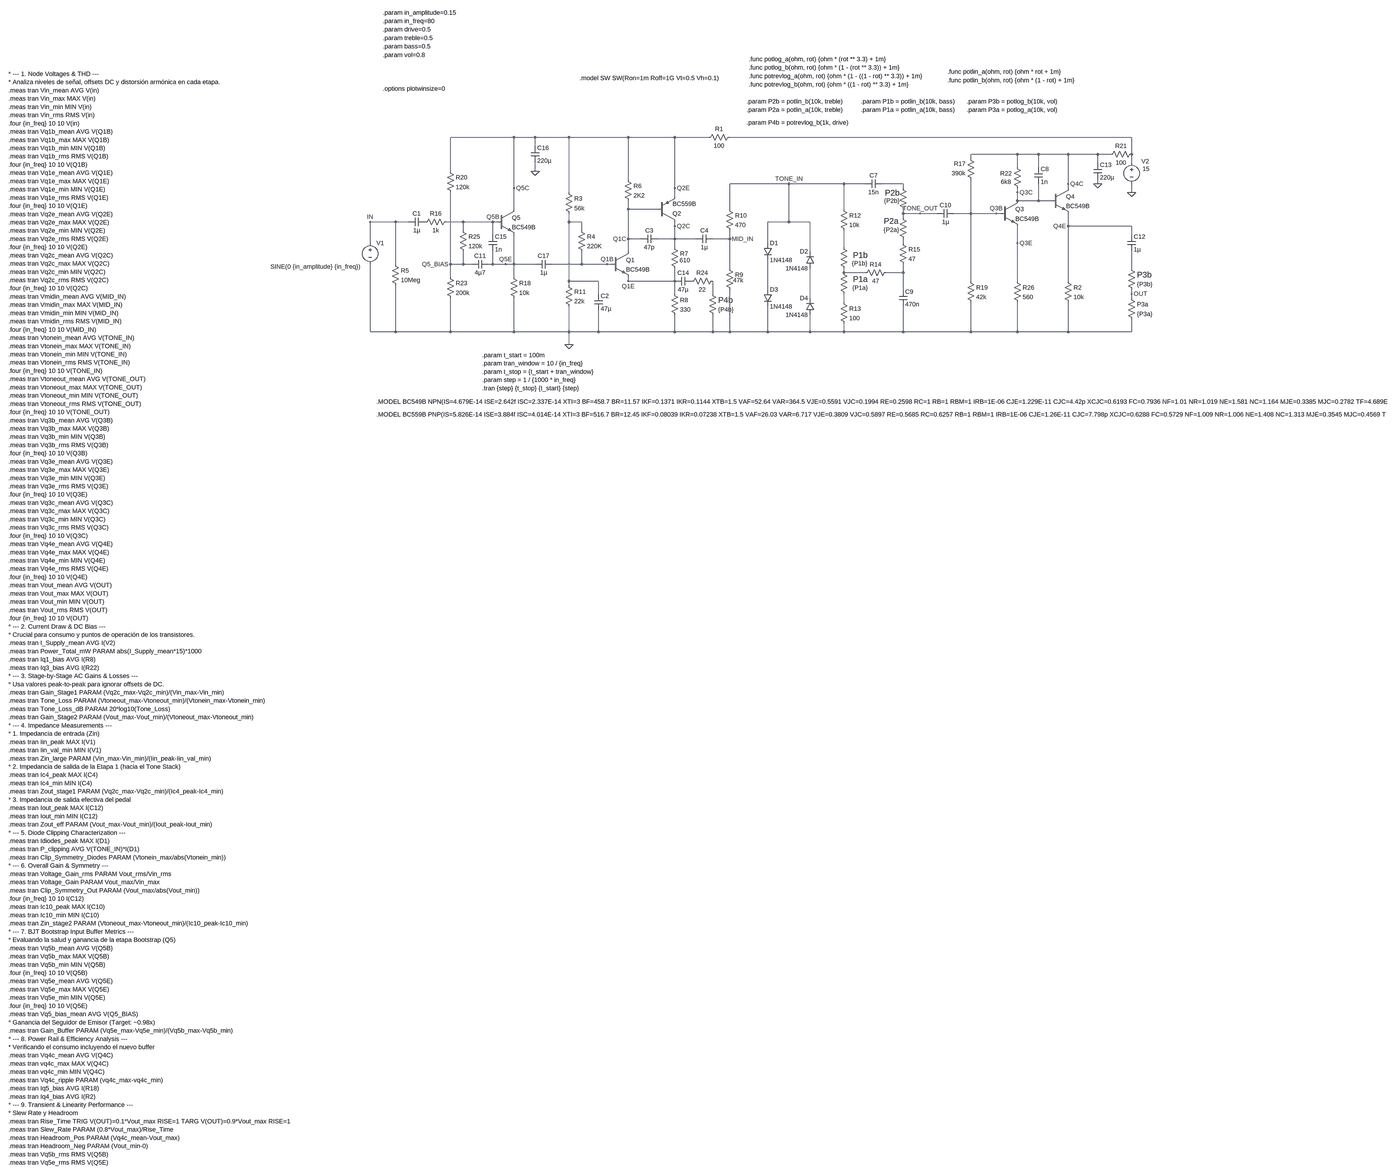
[diagram p0: schematic redesign_15v.asc, whole sheet]
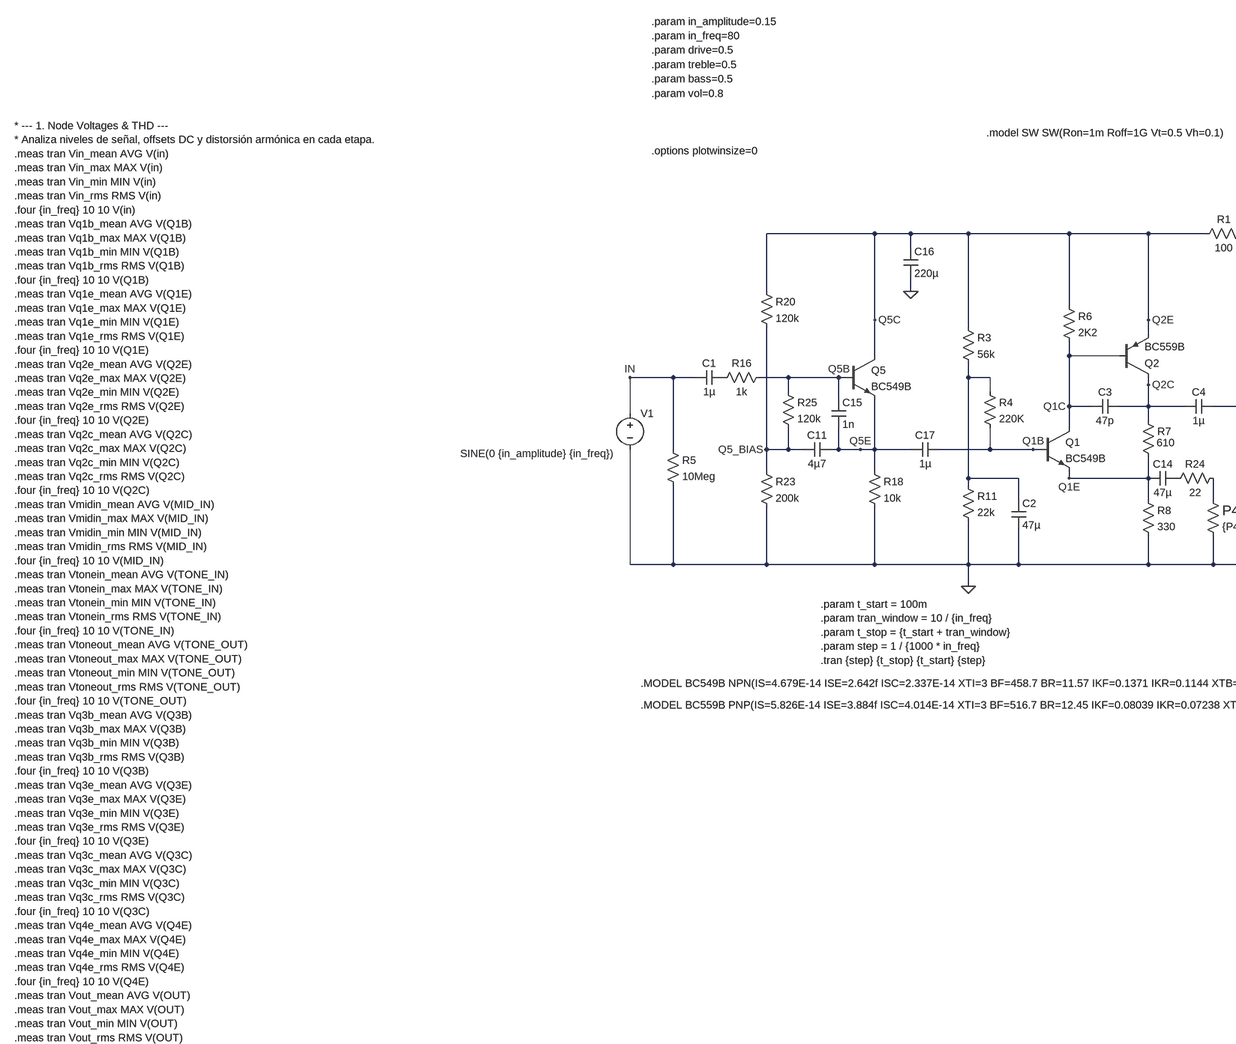
[diagram p1: schematic redesign_15v.asc, part, row 1 of 2, column 1 of 2]
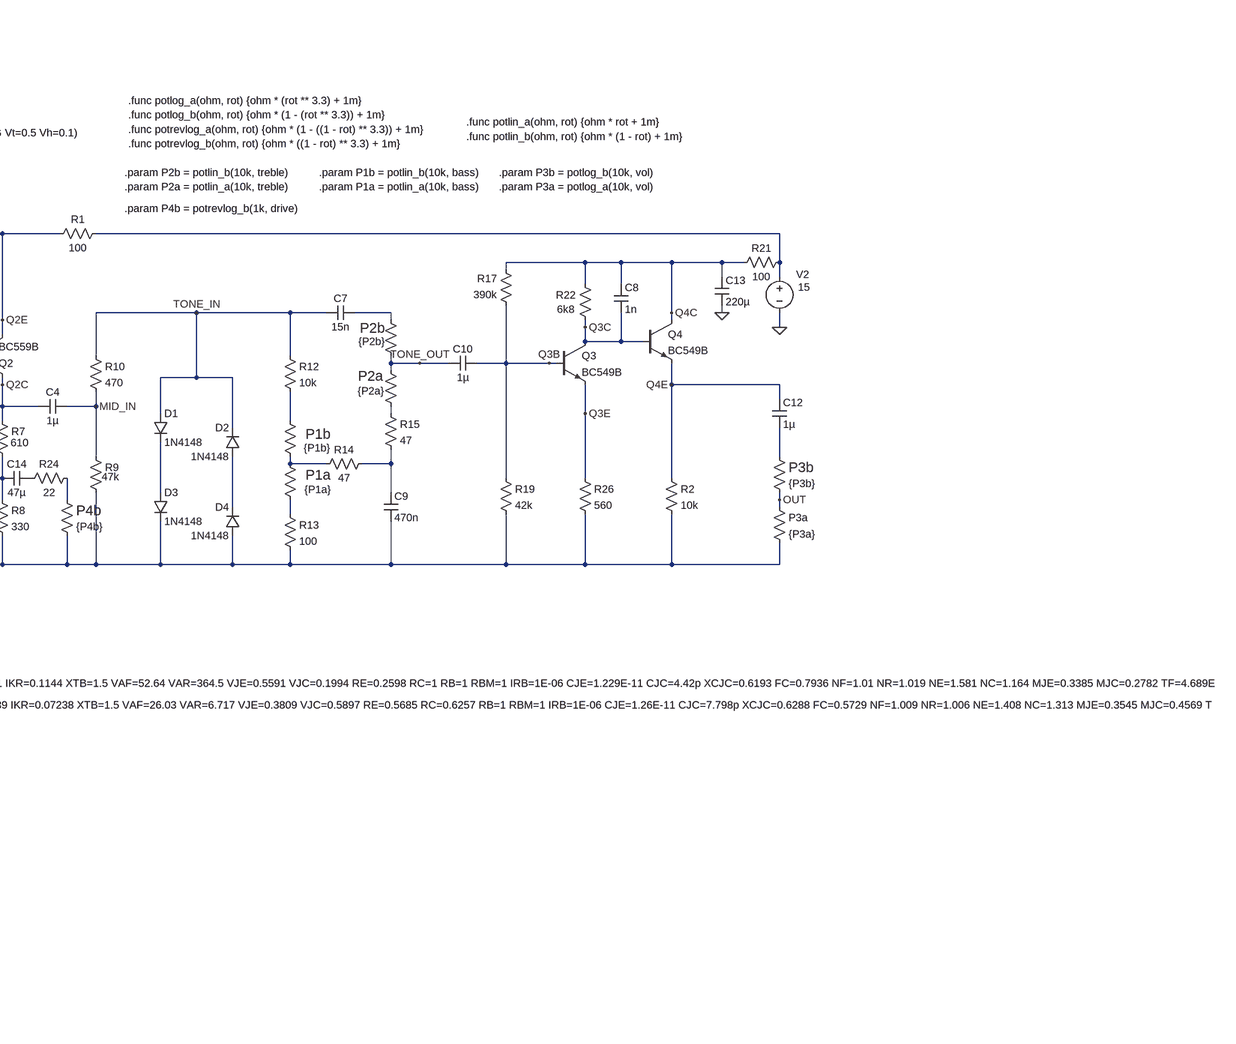
[diagram p2: schematic redesign_15v.asc, part, row 1 of 2, column 2 of 2]
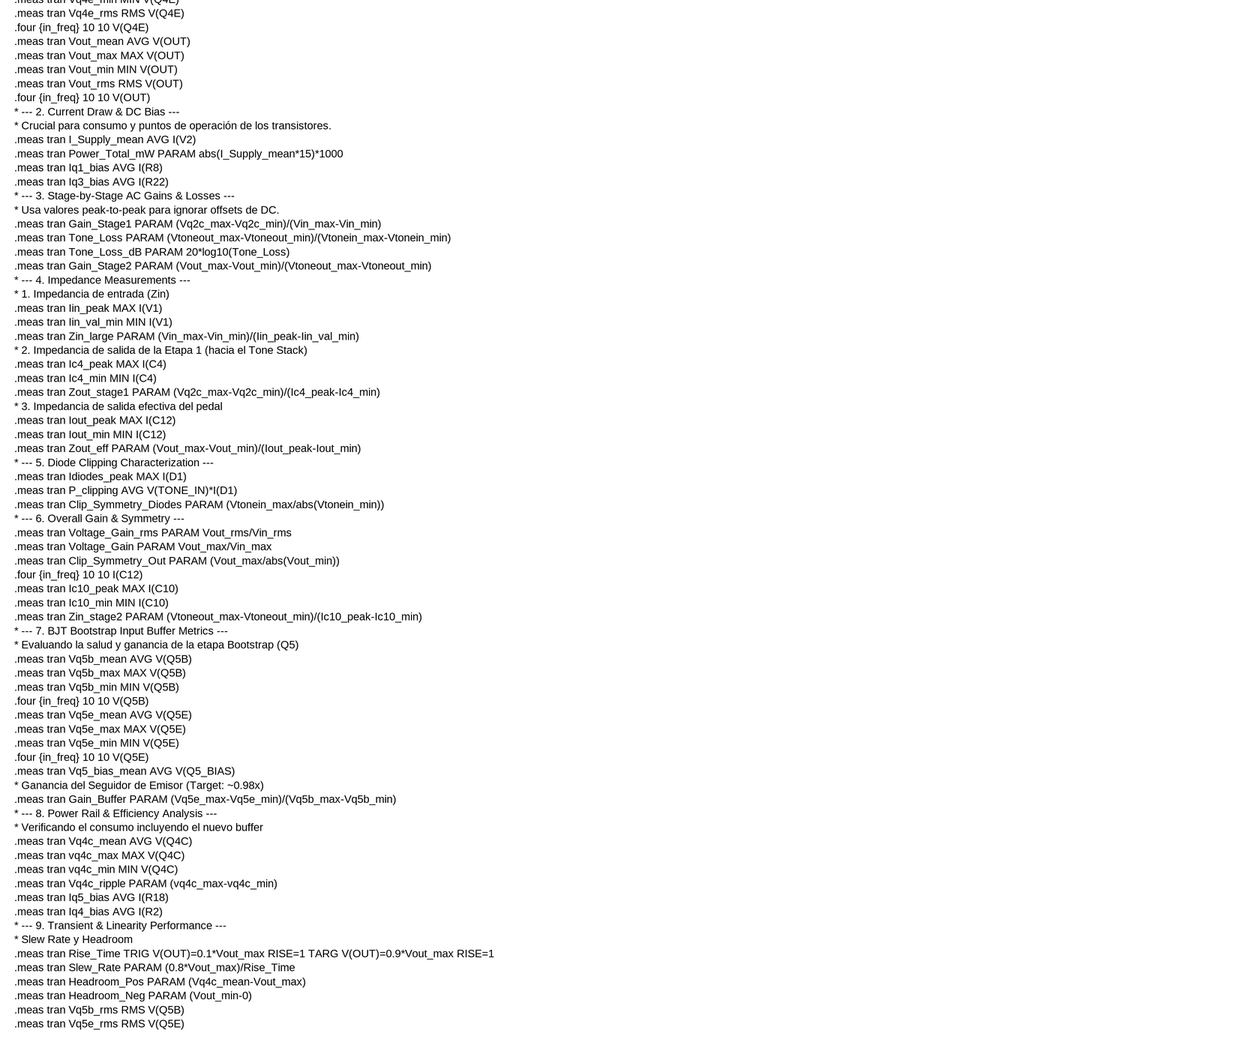
[diagram p3: schematic redesign_15v.asc, part, row 2 of 2, column 1 of 2]
redesign_15v.asc, the LTspice schematic file:
Version 4
SHEET 1 4560 2564
WIRE 96 -160 -144 -160
WIRE 176 -160 96 -160
WIRE 304 -160 176 -160
WIRE 528 -160 304 -160
WIRE 704 -160 528 -160
WIRE 832 -160 704 -160
WIRE 2432 -160 912 -160
WIRE 176 -128 176 -160
WIRE 2000 -96 1824 -96
WIRE 2080 -96 2000 -96
WIRE 2192 -96 2080 -96
WIRE 2304 -96 2192 -96
WIRE 2352 -96 2304 -96
WIRE 2432 -96 2432 -160
WIRE 1824 -80 1824 -96
WIRE 2304 -64 2304 -96
WIRE 2432 -64 2432 -96
WIRE 2000 -48 2000 -96
WIRE 2080 -48 2080 -96
WIRE -144 -32 -144 -160
WIRE 176 -32 176 -64
WIRE 528 0 528 -160
WIRE 1136 16 912 16
WIRE 1344 16 1136 16
WIRE 1424 16 1344 16
WIRE 1568 16 1488 16
WIRE 2192 16 2192 -96
WIRE 2304 16 2304 0
WIRE 96 32 96 -160
WIRE 704 32 704 -160
WIRE 1568 32 1568 16
WIRE 2192 32 2192 16
WIRE 304 48 304 -160
WIRE 2000 48 2000 32
WIRE 2432 48 2432 16
WIRE 704 64 704 32
WIRE 2000 80 2000 48
WIRE 2080 80 2080 16
WIRE 2080 80 2000 80
WIRE 2128 80 2080 80
WIRE 96 112 96 32
WIRE 528 112 528 80
WIRE 640 112 528 112
WIRE 912 112 912 16
WIRE 1344 112 1344 16
WIRE 1568 128 1568 112
WIRE 1632 128 1568 128
WIRE 1696 128 1632 128
WIRE 1824 128 1824 0
WIRE 1824 128 1760 128
WIRE 1920 128 1824 128
WIRE 1936 128 1920 128
WIRE 1568 144 1568 128
WIRE -352 160 -448 160
WIRE -304 160 -352 160
WIRE -96 160 -160 160
WIRE 16 160 -96 160
WIRE 32 160 16 160
WIRE 304 160 304 128
WIRE 352 160 304 160
WIRE 1136 160 1136 16
WIRE 1136 160 1056 160
WIRE 1216 160 1136 160
WIRE 704 176 704 160
WIRE 2192 176 2192 128
WIRE 2432 176 2192 176
WIRE -96 192 -96 160
WIRE 352 192 352 160
WIRE 16 208 16 160
WIRE 2432 208 2432 176
WIRE 528 224 528 112
WIRE 576 224 528 224
WIRE 704 224 704 176
WIRE 704 224 640 224
WIRE 784 224 704 224
WIRE 912 224 912 192
WIRE 912 224 848 224
WIRE -448 240 -448 160
WIRE 1056 240 1056 160
WIRE 1568 240 1568 224
WIRE 2000 240 2000 176
WIRE 704 256 704 224
WIRE 1344 256 1344 192
WIRE 528 272 528 224
WIRE 1216 272 1216 160
WIRE -352 320 -352 160
WIRE -144 320 -144 48
WIRE -96 320 -96 272
WIRE -96 320 -144 320
WIRE -64 320 -96 320
WIRE 16 320 16 272
WIRE 16 320 0 320
WIRE 64 320 16 320
WIRE 96 320 96 208
WIRE 96 320 64 320
WIRE 176 320 96 320
WIRE 352 320 352 272
WIRE 352 320 240 320
WIRE 448 320 352 320
WIRE 464 320 448 320
WIRE 912 336 912 224
WIRE 2432 336 2432 272
WIRE 1344 352 1344 336
WIRE 1424 352 1344 352
WIRE 1568 352 1568 320
WIRE 1568 352 1504 352
WIRE -144 368 -144 320
WIRE 96 368 96 320
WIRE 304 384 304 160
WIRE 416 384 304 384
WIRE 528 384 528 368
WIRE 704 384 704 336
WIRE 704 384 528 384
WIRE 1824 384 1824 128
WIRE 2000 384 2000 240
WIRE 2192 384 2192 176
WIRE 304 400 304 384
WIRE 1056 416 1056 304
WIRE 1568 416 1568 352
WIRE 416 432 416 384
WIRE 704 432 704 384
WIRE 848 432 848 384
WIRE 2432 432 2432 416
WIRE 1216 448 1216 336
WIRE 2432 448 2432 432
WIRE 1344 464 1344 432
WIRE -448 576 -448 320
WIRE -352 576 -352 400
WIRE -352 576 -448 576
WIRE -144 576 -144 448
WIRE -144 576 -352 576
WIRE 96 576 96 448
WIRE 96 576 -144 576
WIRE 304 576 304 480
WIRE 304 576 96 576
WIRE 416 576 416 496
WIRE 416 576 304 576
WIRE 704 576 704 512
WIRE 704 576 416 576
WIRE 848 576 848 512
WIRE 848 576 704 576
WIRE 912 576 912 416
WIRE 912 576 848 576
WIRE 1056 576 1056 480
WIRE 1056 576 912 576
WIRE 1216 576 1216 512
WIRE 1216 576 1056 576
WIRE 1344 576 1344 544
WIRE 1344 576 1216 576
WIRE 1568 576 1568 480
WIRE 1568 576 1344 576
WIRE 1824 576 1824 464
WIRE 1824 576 1568 576
WIRE 2000 576 2000 464
WIRE 2000 576 1824 576
WIRE 2192 576 2192 464
WIRE 2192 576 2000 576
WIRE 2432 576 2432 528
WIRE 2432 576 2192 576
WIRE 304 624 304 576
FLAG 2432 48 0
FLAG 448 320 Q1B
FLAG 528 224 Q1C
FLAG 528 384 Q1E
FLAG 704 176 Q2C
FLAG 704 32 Q2E
FLAG 2000 240 Q3E
FLAG 2432 432 OUT
FLAG 304 624 0
FLAG -448 160 IN
FLAG 2304 16 0
FLAG 1632 128 TONE_OUT
FLAG 1136 16 TONE_IN
FLAG 1920 128 Q3B
FLAG 912 224 MID_IN
FLAG 2192 176 Q4E
FLAG 2192 16 Q4C
FLAG 2000 48 Q3C
FLAG 176 -32 0
FLAG 16 160 Q5B
FLAG 96 32 Q5C
FLAG -144 320 Q5_BIAS
FLAG 64 320 Q5E
DATAFLAG 304 160 "round($*100)/100"
DATAFLAG 352 320 "round($*100)/100"
DATAFLAG 704 224 "round($*100)/100"
DATAFLAG 528 112 "round($*100)/100"
DATAFLAG 1824 48 "round($*100)/100"
DATAFLAG 2000 304 "round($*100)/100"
DATAFLAG 608 384 "round($*100)/100"
DATAFLAG 864 224 "round($*100)/100"
DATAFLAG 2208 -96 "round($*100)/100"
DATAFLAG 2352 176 "round($*100)/100"
DATAFLAG 2048 80 "round($*100)/100"
DATAFLAG 752 -160 "round($*100)/100"
DATAFLAG -48 160 "round($*100)/100"
DATAFLAG 96 272 "round($*100)/100"
DATAFLAG -144 240 "round($*100)/100"
SYMBOL npn 464 272 R0
SYMATTR InstName Q1
SYMATTR Value BC549B
SYMBOL npn 1936 80 R0
SYMATTR InstName Q3
SYMATTR Value BC549B
SYMBOL Cap 640 208 R90
WINDOW 0 0 32 VBottom 2
WINDOW 3 32 32 VTop 2
SYMATTR InstName C3
SYMATTR Value 47p
SYMBOL Cap 848 208 R90
WINDOW 0 0 32 VBottom 2
WINDOW 3 32 32 VTop 2
SYMATTR InstName C4
SYMATTR Value 1µ
SYMBOL Res 688 240 R0
WINDOW 3 34 65 Left 2
SYMATTR Value 610
SYMATTR InstName R7
SYMBOL Res 288 32 R0
SYMATTR InstName R3
SYMATTR Value 56k
SYMBOL Res 512 -16 R0
SYMATTR InstName R6
SYMATTR Value 2K2
SYMBOL Res 896 96 R0
SYMATTR InstName R10
SYMATTR Value 470
SYMBOL Res 688 416 R0
SYMATTR InstName R8
SYMATTR Value 330
SYMBOL Res 1328 240 R0
WINDOW 0 50 46 Left 3
WINDOW 3 46 77 Left 2
SYMATTR InstName P1b
SYMATTR Value {P1b}
SYMBOL Res 1328 336 R0
WINDOW 0 50 41 Left 3
WINDOW 3 48 73 Left 2
SYMATTR InstName P1a
SYMATTR Value {P1a}
SYMBOL Res 1520 336 R90
WINDOW 0 0 56 VBottom 2
WINDOW 3 32 56 VTop 2
SYMATTR InstName R14
SYMATTR Value 47
SYMBOL Cap 1488 0 R90
WINDOW 0 0 32 VBottom 2
WINDOW 3 32 32 VTop 2
SYMATTR InstName C7
SYMATTR Value 15n
SYMBOL Res 1552 16 R0
WINDOW 3 -56 64 Left 2
WINDOW 0 -53 34 Left 3
SYMATTR Value {P2b}
SYMATTR InstName P2b
SYMBOL Res 1552 128 R0
WINDOW 3 -58 62 Left 2
WINDOW 0 -57 29 Left 3
SYMATTR Value {P2a}
SYMATTR InstName P2a
SYMBOL Cap 1552 416 R0
SYMATTR InstName C9
SYMATTR Value 470n
SYMBOL Cap 1760 112 R90
WINDOW 0 0 32 VBottom 2
WINDOW 3 32 32 VTop 2
SYMATTR InstName C10
SYMATTR Value 1µ
SYMBOL Res 1840 16 R180
WINDOW 0 36 76 Left 2
WINDOW 3 36 40 Left 2
SYMATTR InstName R17
SYMATTR Value 390k
SYMBOL Res 1984 368 R0
SYMATTR InstName R26
SYMATTR Value 560
SYMBOL Res 288 384 R0
SYMATTR InstName R11
SYMATTR Value 22k
SYMBOL Res 1808 368 R0
SYMATTR InstName R19
SYMATTR Value 42k
SYMBOL voltage 2432 -80 R0
WINDOW 0 37 11 Left 2
WINDOW 3 41 39 Left 2
SYMATTR InstName V2
SYMATTR Value 15
SYMBOL pnp 640 160 M180
SYMATTR InstName Q2
SYMATTR Value BC559B
SYMBOL Res 2416 432 R0
SYMATTR InstName P3a
SYMATTR Value {P3a}
SYMBOL Res 2416 320 R0
WINDOW 0 36 40 Left 3
SYMATTR InstName P3b
SYMATTR Value {P3b}
SYMBOL Cap 400 432 R0
SYMATTR InstName C2
SYMATTR Value 47µ
SYMBOL Res 336 176 R0
SYMATTR InstName R4
SYMATTR Value 220K
SYMBOL Res 1328 96 R0
SYMATTR InstName R12
SYMATTR Value 10k
SYMBOL Res 1328 448 R0
SYMATTR InstName R13
SYMATTR Value 100
SYMBOL Res 1552 224 R0
SYMATTR InstName R15
SYMATTR Value 47
SYMBOL Res 896 320 R0
WINDOW 3 29 61 Left 2
SYMATTR Value 47k
SYMATTR InstName R9
SYMBOL Res 2448 -112 R90
WINDOW 0 0 56 VBottom 2
WINDOW 3 32 56 VTop 2
SYMATTR InstName R21
SYMATTR Value 100
SYMBOL Cap 2288 -64 R0
SYMATTR InstName C13
SYMATTR Value 220µ
SYMBOL Voltage -448 224 R0
WINDOW 39 0 0 Left 0
WINDOW 3 -377 105 Left 2
SYMATTR Value SINE(0 {in_amplitude} {in_freq})
SYMATTR InstName V1
SYMBOL Res 1984 -64 R0
WINDOW 0 -49 41 Left 2
WINDOW 3 -47 72 Left 2
SYMATTR InstName R22
SYMATTR Value 6k8
SYMBOL Cap 2416 208 R0
SYMATTR InstName C12
SYMATTR Value 1µ
SYMBOL Cap 768 368 R90
WINDOW 0 0 32 VBottom 2
WINDOW 3 32 32 VTop 2
SYMATTR InstName C14
SYMATTR Value 47µ
SYMBOL Res 864 368 R90
WINDOW 0 0 56 VBottom 2
WINDOW 3 32 56 VTop 2
SYMATTR InstName R24
SYMATTR Value 22
SYMBOL Res 832 416 R0
WINDOW 0 36 40 Left 3
SYMATTR InstName P4b
SYMATTR Value {P4b}
SYMBOL npn 2128 32 R0
SYMATTR InstName Q4
SYMATTR Value BC549B
SYMBOL Res 2176 368 R0
SYMATTR InstName R2
SYMATTR Value 10k
SYMBOL Cap 2064 -48 R0
SYMATTR InstName C8
SYMATTR Value 1n
SYMBOL Res 928 -176 R90
WINDOW 0 0 56 VBottom 2
WINDOW 3 32 56 VTop 2
SYMATTR InstName R1
SYMATTR Value 100
SYMBOL Cap 160 -128 R0
SYMATTR InstName C16
SYMATTR Value 220µ
SYMBOL npn 32 112 R0
SYMATTR InstName Q5
SYMATTR Value BC549B
SYMBOL Res -368 304 R0
SYMATTR InstName R5
SYMATTR Value 10Meg
SYMBOL Cap -240 144 R90
WINDOW 0 0 32 VBottom 2
WINDOW 3 32 32 VTop 2
SYMATTR InstName C1
SYMATTR Value 1µ
SYMBOL Res -144 144 R90
WINDOW 0 0 56 VBottom 2
WINDOW 3 32 56 VTop 2
SYMATTR InstName R16
SYMATTR Value 1k
SYMBOL Res 80 352 R0
SYMATTR InstName R18
SYMATTR Value 10k
SYMBOL Res -160 -48 R0
SYMATTR InstName R20
SYMATTR Value 120k
SYMBOL Res -160 352 R0
SYMATTR InstName R23
SYMATTR Value 200k
SYMBOL Res -112 176 R0
SYMATTR InstName R25
SYMATTR Value 120k
SYMBOL Cap 0 304 R90
WINDOW 0 0 32 VBottom 2
WINDOW 3 32 32 VTop 2
SYMATTR InstName C11
SYMATTR Value 4µ7
SYMBOL Cap 0 208 R0
SYMATTR InstName C15
SYMATTR Value 1n
SYMBOL Cap 240 304 R90
WINDOW 0 0 32 VBottom 2
WINDOW 3 32 32 VTop 2
SYMATTR InstName C17
SYMATTR Value 1µ
SYMBOL diode 1040 240 R0
SYMATTR InstName D1
SYMATTR Value 1N4148
SYMBOL diode 1040 416 R0
SYMATTR InstName D3
SYMATTR Value 1N4148
SYMBOL diode 1232 336 R180
WINDOW 0 24 64 Left 2
WINDOW 3 24 0 Left 2
SYMATTR InstName D2
SYMATTR Value 1N4148
SYMBOL diode 1232 512 R180
WINDOW 0 24 64 Left 2
WINDOW 3 24 0 Left 2
SYMATTR InstName D4
SYMATTR Value 1N4148
TEXT -400 -536 Left 2 !.param treble=0.5
TEXT -400 -568 Left 2 !.param drive=0.5
TEXT 984 -456 Left 2 !.func potlog_a(ohm, rot) {ohm * (rot ** 3.3) + 1m}
TEXT 976 -296 Left 2 !.param P2b = potlin_b(10k, treble)
TEXT 976 -264 Left 2 !.param P2a = potlin_a(10k, treble)
TEXT 1408 -296 Left 2 !.param P1b = potlin_b(10k, bass)
TEXT 1408 -264 Left 2 !.param P1a = potlin_a(10k, bass)
TEXT -400 -504 Left 2 !.param bass=0.5
TEXT 1808 -296 Left 2 !.param P3b = potlog_b(10k, vol)
TEXT 1808 -264 Left 2 !.param P3a = potlog_a(10k, vol)
TEXT -400 -472 Left 2 !.param vol=0.8
TEXT 984 -424 Left 2 !.func potlog_b(ohm, rot) {ohm * (1 - (rot ** 3.3)) + 1m}
TEXT 1736 -408 Left 2 !.func potlin_a(ohm, rot) {ohm * rot + 1m}
TEXT 1736 -376 Left 2 !.func potlin_b(ohm, rot) {ohm * (1 - rot) + 1m}
TEXT 344 -384 Left 2 !.model SW SW(Ron=1m Roff=1G Vt=0.5 Vh=0.1)
TEXT -400 -632 Left 2 !.param in_amplitude=0.15
TEXT -400 -600 Left 2 !.param in_freq=80
TEXT -400 -344 Left 2 !.options plotwinsize=0
TEXT -24 664 Left 2 !.param t_start = 100m\n.param tran_window = 10 / {in_freq}\n.param t_stop = {t_start + tran_window}\n.param step = 1 / {1000 * in_freq}\n.tran {step} {t_stop} {t_start} {step}
TEXT -1816 -400 Left 2 !* --- 1. Node Voltages & THD ---\n* Analiza niveles de señal, offsets DC y distorsión armónica en cada etapa.\n.meas tran Vin_mean AVG V(in)\n.meas tran Vin_max MAX V(in)\n.meas tran Vin_min MIN V(in)\n.meas tran Vin_rms RMS V(in)\n.four {in_freq} 10 10 V(in)\n.meas tran Vq1b_mean AVG V(Q1B)\n.meas tran Vq1b_max MAX V(Q1B)\n.meas tran Vq1b_min MIN V(Q1B)\n.meas tran Vq1b_rms RMS V(Q1B)\n.four {in_freq} 10 10 V(Q1B)\n.meas tran Vq1e_mean AVG V(Q1E)\n.meas tran Vq1e_max MAX V(Q1E)\n.meas tran Vq1e_min MIN V(Q1E)\n.meas tran Vq1e_rms RMS V(Q1E)\n.four {in_freq} 10 10 V(Q1E)\n.meas tran Vq2e_mean AVG V(Q2E)\n.meas tran Vq2e_max MAX V(Q2E)\n.meas tran Vq2e_min MIN V(Q2E)\n.meas tran Vq2e_rms RMS V(Q2E)\n.four {in_freq} 10 10 V(Q2E)\n.meas tran Vq2c_mean AVG V(Q2C)\n.meas tran Vq2c_max MAX V(Q2C)\n.meas tran Vq2c_min MIN V(Q2C)\n.meas tran Vq2c_rms RMS V(Q2C)\n.four {in_freq} 10 10 V(Q2C)\n.meas tran Vmidin_mean AVG V(MID_IN)\n.meas tran Vmidin_max MAX V(MID_IN)\n.meas tran Vmidin_min MIN V(MID_IN)\n.meas tran Vmidin_rms RMS V(MID_IN)\n.four {in_freq} 10 10 V(MID_IN)\n.meas tran Vtonein_mean AVG V(TONE_IN)\n.meas tran Vtonein_max MAX V(TONE_IN)\n.meas tran Vtonein_min MIN V(TONE_IN)\n.meas tran Vtonein_rms RMS V(TONE_IN)\n.four {in_freq} 10 10 V(TONE_IN)\n.meas tran Vtoneout_mean AVG V(TONE_OUT)\n.meas tran Vtoneout_max MAX V(TONE_OUT)\n.meas tran Vtoneout_min MIN V(TONE_OUT)\n.meas tran Vtoneout_rms RMS V(TONE_OUT)\n.four {in_freq} 10 10 V(TONE_OUT)\n.meas tran Vq3b_mean AVG V(Q3B)\n.meas tran Vq3b_max MAX V(Q3B)\n.meas tran Vq3b_min MIN V(Q3B)\n.meas tran Vq3b_rms RMS V(Q3B)\n.four {in_freq} 10 10 V(Q3B)\n.meas tran Vq3e_mean AVG V(Q3E)\n.meas tran Vq3e_max MAX V(Q3E)\n.meas tran Vq3e_min MIN V(Q3E)\n.meas tran Vq3e_rms RMS V(Q3E)\n.four {in_freq} 10 10 V(Q3E)\n.meas tran Vq3c_mean AVG V(Q3C)\n.meas tran Vq3c_max MAX V(Q3C)\n.meas tran Vq3c_min MIN V(Q3C)\n.meas tran Vq3c_rms RMS V(Q3C)\n.four {in_freq} 10 10 V(Q3C)\n.meas tran Vq4e_mean AVG V(Q4E)\n.meas tran Vq4e_max MAX V(Q4E)\n.meas tran Vq4e_min MIN V(Q4E)\n.meas tran Vq4e_rms RMS V(Q4E)\n.four {in_freq} 10 10 V(Q4E)\n.meas tran Vout_mean AVG V(OUT)\n.meas tran Vout_max MAX V(OUT)\n.meas tran Vout_min MIN V(OUT)\n.meas tran Vout_rms RMS V(OUT)\n.four {in_freq} 10 10 V(OUT)\n* --- 2. Current Draw & DC Bias ---\n* Crucial para consumo y puntos de operación de los transistores.\n.meas tran I_Supply_mean AVG I(V2)\n.meas tran Power_Total_mW PARAM abs(I_Supply_mean*15)*1000\n.meas tran Iq1_bias AVG I(R8)\n.meas tran Iq3_bias AVG I(R22)\n* --- 3. Stage-by-Stage AC Gains & Losses ---\n* Usa valores peak-to-peak para ignorar offsets de DC.\n.meas tran Gain_Stage1 PARAM (Vq2c_max-Vq2c_min)/(Vin_max-Vin_min)\n.meas tran Tone_Loss PARAM (Vtoneout_max-Vtoneout_min)/(Vtonein_max-Vtonein_min)\n.meas tran Tone_Loss_dB PARAM 20*log10(Tone_Loss)\n.meas tran Gain_Stage2 PARAM (Vout_max-Vout_min)/(Vtoneout_max-Vtoneout_min)\n* --- 4. Impedance Measurements ---\n* 1. Impedancia de entrada (Zin)\n.meas tran Iin_peak MAX I(V1)\n.meas tran Iin_val_min MIN I(V1)\n.meas tran Zin_large PARAM (Vin_max-Vin_min)/(Iin_peak-Iin_val_min)\n* 2. Impedancia de salida de la Etapa 1 (hacia el Tone Stack)\n.meas tran Ic4_peak MAX I(C4)\n.meas tran Ic4_min MIN I(C4)\n.meas tran Zout_stage1 PARAM (Vq2c_max-Vq2c_min)/(Ic4_peak-Ic4_min)\n* 3. Impedancia de salida efectiva del pedal\n.meas tran Iout_peak MAX I(C12)\n.meas tran Iout_min MIN I(C12)\n.meas tran Zout_eff PARAM (Vout_max-Vout_min)/(Iout_peak-Iout_min)\n* --- 5. Diode Clipping Characterization ---\n.meas tran Idiodes_peak MAX I(D1)\n.meas tran P_clipping AVG V(TONE_IN)*I(D1)\n.meas tran Clip_Symmetry_Diodes PARAM (Vtonein_max/abs(Vtonein_min))\n* --- 6. Overall Gain & Symmetry ---\n.meas tran Voltage_Gain_rms PARAM Vout_rms/Vin_rms\n.meas tran Voltage_Gain PARAM Vout_max/Vin_max\n.meas tran Clip_Symmetry_Out PARAM (Vout_max/abs(Vout_min))\n.four {in_freq} 10 10 I(C12)\n.meas tran Ic10_peak MAX I(C10)\n.meas tran Ic10_min MIN I(C10)\n.meas tran Zin_stage2 PARAM (Vtoneout_max-Vtoneout_min)/(Ic10_peak-Ic10_min)\n* --- 7. BJT Bootstrap Input Buffer Metrics ---\n* Evaluando la salud y ganancia de la etapa Bootstrap (Q5)\n.meas tran Vq5b_mean AVG V(Q5B)\n.meas tran Vq5b_max MAX V(Q5B)\n.meas tran Vq5b_min MIN V(Q5B)\n.four {in_freq} 10 10 V(Q5B)\n.meas tran Vq5e_mean AVG V(Q5E)\n.meas tran Vq5e_max MAX V(Q5E)\n.meas tran Vq5e_min MIN V(Q5E)\n.four {in_freq} 10 10 V(Q5E)\n.meas tran Vq5_bias_mean AVG V(Q5_BIAS)\n* Ganancia del Seguidor de Emisor (Target: ~0.98x)\n.meas tran Gain_Buffer PARAM (Vq5e_max-Vq5e_min)/(Vq5b_max-Vq5b_min)\n* --- 8. Power Rail & Efficiency Analysis ---\n* Verificando el consumo incluyendo el nuevo buffer\n.meas tran Vq4c_mean AVG V(Q4C)\n.meas tran vq4c_max MAX V(Q4C)\n.meas tran vq4c_min MIN V(Q4C)\n.meas tran Vq4c_ripple PARAM (vq4c_max-vq4c_min)\n.meas tran Iq5_bias AVG I(R18)\n.meas tran Iq4_bias AVG I(R2)\n* --- 9. Transient & Linearity Performance ---\n* Slew Rate y Headroom\n.meas tran Rise_Time TRIG V(OUT)=0.1*Vout_max RISE=1 TARG V(OUT)=0.9*Vout_max RISE=1\n.meas tran Slew_Rate PARAM (0.8*Vout_max)/Rise_Time\n.meas tran Headroom_Pos PARAM (Vq4c_mean-Vout_max)\n.meas tran Headroom_Neg PARAM (Vout_min-0)\n.meas tran Vq5b_rms RMS V(Q5B)\n.meas tran Vq5e_rms RMS V(Q5E)
TEXT 976 -216 Left 2 !.param P4b = potrevlog_b(1k, drive)
TEXT 984 -392 Left 2 !.func potrevlog_a(ohm, rot) {ohm * (1 - ((1 - rot) ** 3.3)) + 1m}
TEXT 984 -360 Left 2 !.func potrevlog_b(ohm, rot) {ohm * ((1 - rot) ** 3.3) + 1m}
TEXT -424 840 Left 2 !.MODEL BC549B NPN(IS=4.679E-14 ISE=2.642f ISC=2.337E-14 XTI=3 BF=458.7 BR=11.57 IKF=0.1371 IKR=0.1144 XTB=1.5 VAF=52.64 VAR=364.5 VJE=0.5591 VJC=0.1994 RE=0.2598 RC=1 RB=1 RBM=1 IRB=1E-06 CJE=1.229E-11 CJC=4.42p XCJC=0.6193 FC=0.7936 NF=1.01 NR=1.019 NE=1.581 NC=1.164 MJE=0.3385 MJC=0.2782 TF=4.689E-10 TR=1m2 ITF=0.8842 VTF=2.828 XTF=160 EG=1.11 VCEO=30 ICRATING=100m MFG=PHILIPS)
TEXT -424 888 Left 2 !.MODEL BC559B PNP(IS=5.826E-14 ISE=3.884f ISC=4.014E-14 XTI=3 BF=516.7 BR=12.45 IKF=0.08039 IKR=0.07238 XTB=1.5 VAF=26.03 VAR=6.717 VJE=0.3809 VJC=0.5897 RE=0.5685 RC=0.6257 RB=1 RBM=1 IRB=1E-06 CJE=1.26E-11 CJC=7.798p XCJC=0.6288 FC=0.5729 NF=1.009 NR=1.006 NE=1.408 NC=1.313 MJE=0.3545 MJC=0.4569 TF=5.233E-10 TR=1m2 ITF=0.1896 VTF=5.425 XTF=4.339 EG=1.11 VCEO=45 ICRATING=100M MFG=PHILIPS)

The netlist it stands for:
* redesign_15v.asc
Q1 Q1C Q1B Q1E 0 BC549B
Q3 Q3C Q3B Q3E 0 BC549B
C3 Q2C Q1C 47p
C4 MID_IN Q2C 1µ
R7 Q2C Q1E 610
R3 Q5C N003 56k
R6 Q5C Q1C 2K2
R10 TONE_IN MID_IN 470
R8 Q1E 0 330
R§P1b N005 N007 {P1b}
R§P1a N007 N012 {P1a}
R14 N008 N007 47
C7 N002 TONE_IN 15n
R§P2b N002 TONE_OUT {P2b}
R§P2a TONE_OUT N004 {P2a}
C9 N008 0 470n
C10 Q3B TONE_OUT 1µ
R17 Q3B Q4C 390k
R26 Q3E 0 560
R11 N003 0 22k
R19 Q3B 0 42k
V2 N001 0 15
Q2 Q2C Q1C Q5C 0 BC559B
R§P3a OUT 0 {P3a}
R§P3b N006 OUT {P3b}
C2 N003 0 47µ
R4 N003 Q1B 220K
R12 TONE_IN N005 10k
R13 N012 0 100
R15 N004 N008 47
R9 MID_IN 0 47k
R21 N001 Q4C 100
C13 Q4C 0 220µ
V1 IN 0 SINE(0 {in_amplitude} {in_freq})
R22 Q4C Q3C 6k8
C12 Q4E N006 1µ
C14 P001 Q1E 47µ
R24 N010 P001 22
R§P4b N010 0 {P4b}
Q4 Q4C Q3C Q4E 0 BC549B
R2 Q4E 0 10k
C8 Q4C Q3C 1n
R1 N001 Q5C 100
C16 Q5C 0 220µ
Q5 Q5C Q5B Q5E 0 BC549B
R5 IN 0 10Meg
C1 P002 IN 1µ
R16 Q5B P002 1k
R18 Q5E 0 10k
R20 Q5C Q5_BIAS 120k
R23 Q5_BIAS 0 200k
R25 Q5B Q5_BIAS 120k
C11 Q5E Q5_BIAS 4µ7
C15 Q5B Q5E 1n
C17 Q1B Q5E 1µ
D1 TONE_IN N009 1N4148
D3 N009 0 1N4148
D2 N011 TONE_IN 1N4148
D4 0 N011 1N4148
.model D D
.lib standard.dio
.model NPN NPN
.model PNP PNP
.lib standard.bjt
.param treble=0.5
.param drive=0.5
.func potlog_a(ohm, rot) {ohm * (rot ** 3.3) + 1m}
.param P2b = potlin_b(10k, treble)
.param P2a = potlin_a(10k, treble)
.param P1b = potlin_b(10k, bass)
.param P1a = potlin_a(10k, bass)
.param bass=0.5
.param P3b = potlog_b(10k, vol)
.param P3a = potlog_a(10k, vol)
.param vol=0.8
.func potlog_b(ohm, rot) {ohm * (1 - (rot ** 3.3)) + 1m}
.func potlin_a(ohm, rot) {ohm * rot + 1m}
.func potlin_b(ohm, rot) {ohm * (1 - rot) + 1m}
.model SW SW(Ron=1m Roff=1G Vt=0.5 Vh=0.1)
.param in_amplitude=0.15
.param in_freq=80
.options plotwinsize=0
.param t_start = 100m
.param tran_window = 10 / {in_freq}
.param t_stop = {t_start + tran_window}
.param step = 1 / {1000 * in_freq}
.tran {step} {t_stop} {t_start} {step}
* --- 1. Node Voltages & THD ---
* Analiza niveles de señal, offsets DC y distorsión armónica en cada etapa.
.meas tran Vin_mean AVG V(in)
.meas tran Vin_max MAX V(in)
.meas tran Vin_min MIN V(in)
.meas tran Vin_rms RMS V(in)
.four {in_freq} 10 10 V(in)
.meas tran Vq1b_mean AVG V(Q1B)
.meas tran Vq1b_max MAX V(Q1B)
.meas tran Vq1b_min MIN V(Q1B)
.meas tran Vq1b_rms RMS V(Q1B)
.four {in_freq} 10 10 V(Q1B)
.meas tran Vq1e_mean AVG V(Q1E)
.meas tran Vq1e_max MAX V(Q1E)
.meas tran Vq1e_min MIN V(Q1E)
.meas tran Vq1e_rms RMS V(Q1E)
.four {in_freq} 10 10 V(Q1E)
.meas tran Vq2e_mean AVG V(Q2E)
.meas tran Vq2e_max MAX V(Q2E)
.meas tran Vq2e_min MIN V(Q2E)
.meas tran Vq2e_rms RMS V(Q2E)
.four {in_freq} 10 10 V(Q2E)
.meas tran Vq2c_mean AVG V(Q2C)
.meas tran Vq2c_max MAX V(Q2C)
.meas tran Vq2c_min MIN V(Q2C)
.meas tran Vq2c_rms RMS V(Q2C)
.four {in_freq} 10 10 V(Q2C)
.meas tran Vmidin_mean AVG V(MID_IN)
.meas tran Vmidin_max MAX V(MID_IN)
.meas tran Vmidin_min MIN V(MID_IN)
.meas tran Vmidin_rms RMS V(MID_IN)
.four {in_freq} 10 10 V(MID_IN)
.meas tran Vtonein_mean AVG V(TONE_IN)
.meas tran Vtonein_max MAX V(TONE_IN)
.meas tran Vtonein_min MIN V(TONE_IN)
.meas tran Vtonein_rms RMS V(TONE_IN)
.four {in_freq} 10 10 V(TONE_IN)
.meas tran Vtoneout_mean AVG V(TONE_OUT)
.meas tran Vtoneout_max MAX V(TONE_OUT)
.meas tran Vtoneout_min MIN V(TONE_OUT)
.meas tran Vtoneout_rms RMS V(TONE_OUT)
.four {in_freq} 10 10 V(TONE_OUT)
.meas tran Vq3b_mean AVG V(Q3B)
.meas tran Vq3b_max MAX V(Q3B)
.meas tran Vq3b_min MIN V(Q3B)
.meas tran Vq3b_rms RMS V(Q3B)
.four {in_freq} 10 10 V(Q3B)
.meas tran Vq3e_mean AVG V(Q3E)
.meas tran Vq3e_max MAX V(Q3E)
.meas tran Vq3e_min MIN V(Q3E)
.meas tran Vq3e_rms RMS V(Q3E)
.four {in_freq} 10 10 V(Q3E)
.meas tran Vq3c_mean AVG V(Q3C)
.meas tran Vq3c_max MAX V(Q3C)
.meas tran Vq3c_min MIN V(Q3C)
.meas tran Vq3c_rms RMS V(Q3C)
.four {in_freq} 10 10 V(Q3C)
.meas tran Vq4e_mean AVG V(Q4E)
.meas tran Vq4e_max MAX V(Q4E)
.meas tran Vq4e_min MIN V(Q4E)
.meas tran Vq4e_rms RMS V(Q4E)
.four {in_freq} 10 10 V(Q4E)
.meas tran Vout_mean AVG V(OUT)
.meas tran Vout_max MAX V(OUT)
.meas tran Vout_min MIN V(OUT)
.meas tran Vout_rms RMS V(OUT)
.four {in_freq} 10 10 V(OUT)
* --- 2. Current Draw & DC Bias ---
* Crucial para consumo y puntos de operación de los transistores.
.meas tran I_Supply_mean AVG I(V2)
.meas tran Power_Total_mW PARAM abs(I_Supply_mean*15)*1000
.meas tran Iq1_bias AVG I(R8)
.meas tran Iq3_bias AVG I(R22)
* --- 3. Stage-by-Stage AC Gains & Losses ---
* Usa valores peak-to-peak para ignorar offsets de DC.
.meas tran Gain_Stage1 PARAM (Vq2c_max-Vq2c_min)/(Vin_max-Vin_min)
.meas tran Tone_Loss PARAM (Vtoneout_max-Vtoneout_min)/(Vtonein_max-Vtonein_min)
.meas tran Tone_Loss_dB PARAM 20*log10(Tone_Loss)
.meas tran Gain_Stage2 PARAM (Vout_max-Vout_min)/(Vtoneout_max-Vtoneout_min)
* --- 4. Impedance Measurements ---
* 1. Impedancia de entrada (Zin)
.meas tran Iin_peak MAX I(V1)
.meas tran Iin_val_min MIN I(V1)
.meas tran Zin_large PARAM (Vin_max-Vin_min)/(Iin_peak-Iin_val_min)
* 2. Impedancia de salida de la Etapa 1 (hacia el Tone Stack)
.meas tran Ic4_peak MAX I(C4)
.meas tran Ic4_min MIN I(C4)
.meas tran Zout_stage1 PARAM (Vq2c_max-Vq2c_min)/(Ic4_peak-Ic4_min)
* 3. Impedancia de salida efectiva del pedal
.meas tran Iout_peak MAX I(C12)
.meas tran Iout_min MIN I(C12)
.meas tran Zout_eff PARAM (Vout_max-Vout_min)/(Iout_peak-Iout_min)
* --- 5. Diode Clipping Characterization ---
.meas tran Idiodes_peak MAX I(D1)
.meas tran P_clipping AVG V(TONE_IN)*I(D1)
.meas tran Clip_Symmetry_Diodes PARAM (Vtonein_max/abs(Vtonein_min))
* --- 6. Overall Gain & Symmetry ---
.meas tran Voltage_Gain_rms PARAM Vout_rms/Vin_rms
.meas tran Voltage_Gain PARAM Vout_max/Vin_max
.meas tran Clip_Symmetry_Out PARAM (Vout_max/abs(Vout_min))
.four {in_freq} 10 10 I(C12)
.meas tran Ic10_peak MAX I(C10)
.meas tran Ic10_min MIN I(C10)
.meas tran Zin_stage2 PARAM (Vtoneout_max-Vtoneout_min)/(Ic10_peak-Ic10_min)
* --- 7. BJT Bootstrap Input Buffer Metrics ---
* Evaluando la salud y ganancia de la etapa Bootstrap (Q5)
.meas tran Vq5b_mean AVG V(Q5B)
.meas tran Vq5b_max MAX V(Q5B)
.meas tran Vq5b_min MIN V(Q5B)
.four {in_freq} 10 10 V(Q5B)
.meas tran Vq5e_mean AVG V(Q5E)
.meas tran Vq5e_max MAX V(Q5E)
.meas tran Vq5e_min MIN V(Q5E)
.four {in_freq} 10 10 V(Q5E)
.meas tran Vq5_bias_mean AVG V(Q5_BIAS)
* Ganancia del Seguidor de Emisor (Target: ~0.98x)
.meas tran Gain_Buffer PARAM (Vq5e_max-Vq5e_min)/(Vq5b_max-Vq5b_min)
* --- 8. Power Rail & Efficiency Analysis ---
* Verificando el consumo incluyendo el nuevo buffer
.meas tran Vq4c_mean AVG V(Q4C)
.meas tran vq4c_max MAX V(Q4C)
.meas tran vq4c_min MIN V(Q4C)
.meas tran Vq4c_ripple PARAM (vq4c_max-vq4c_min)
.meas tran Iq5_bias AVG I(R18)
.meas tran Iq4_bias AVG I(R2)
* --- 9. Transient & Linearity Performance ---
* Slew Rate y Headroom
.meas tran Rise_Time TRIG V(OUT)=0.1*Vout_max RISE=1 TARG V(OUT)=0.9*Vout_max RISE=1
.meas tran Slew_Rate PARAM (0.8*Vout_max)/Rise_Time
.meas tran Headroom_Pos PARAM (Vq4c_mean-Vout_max)
.meas tran Headroom_Neg PARAM (Vout_min-0)
.meas tran Vq5b_rms RMS V(Q5B)
.meas tran Vq5e_rms RMS V(Q5E)
.param P4b = potrevlog_b(1k, drive)
.func potrevlog_a(ohm, rot) {ohm * (1 - ((1 - rot) ** 3.3)) + 1m}
.func potrevlog_b(ohm, rot) {ohm * ((1 - rot) ** 3.3) + 1m}
.MODEL BC549B NPN(IS=4.679E-14 ISE=2.642f ISC=2.337E-14 XTI=3 BF=458.7 BR=11.57 IKF=0.1371 IKR=0.1144 XTB=1.5 VAF=52.64 VAR=364.5 VJE=0.5591 VJC=0.1994 RE=0.2598 RC=1 RB=1 RBM=1 IRB=1E-06 CJE=1.229E-11 CJC=4.42p XCJC=0.6193 FC=0.7936 NF=1.01 NR=1.019 NE=1.581 NC=1.164 MJE=0.3385 MJC=0.2782 TF=4.689E-10 TR=1m2 ITF=0.8842 VTF=2.828 XTF=160 EG=1.11 VCEO=30 ICRATING=100m MFG=PHILIPS)
.MODEL BC559B PNP(IS=5.826E-14 ISE=3.884f ISC=4.014E-14 XTI=3 BF=516.7 BR=12.45 IKF=0.08039 IKR=0.07238 XTB=1.5 VAF=26.03 VAR=6.717 VJE=0.3809 VJC=0.5897 RE=0.5685 RC=0.6257 RB=1 RBM=1 IRB=1E-06 CJE=1.26E-11 CJC=7.798p XCJC=0.6288 FC=0.5729 NF=1.009 NR=1.006 NE=1.408 NC=1.313 MJE=0.3545 MJC=0.4569 TF=5.233E-10 TR=1m2 ITF=0.1896 VTF=5.425 XTF=4.339 EG=1.11 VCEO=45 ICRATING=100M MFG=PHILIPS)
.backanno
.end